# Altium schematic sheet Motor Control.SchDoc
size A
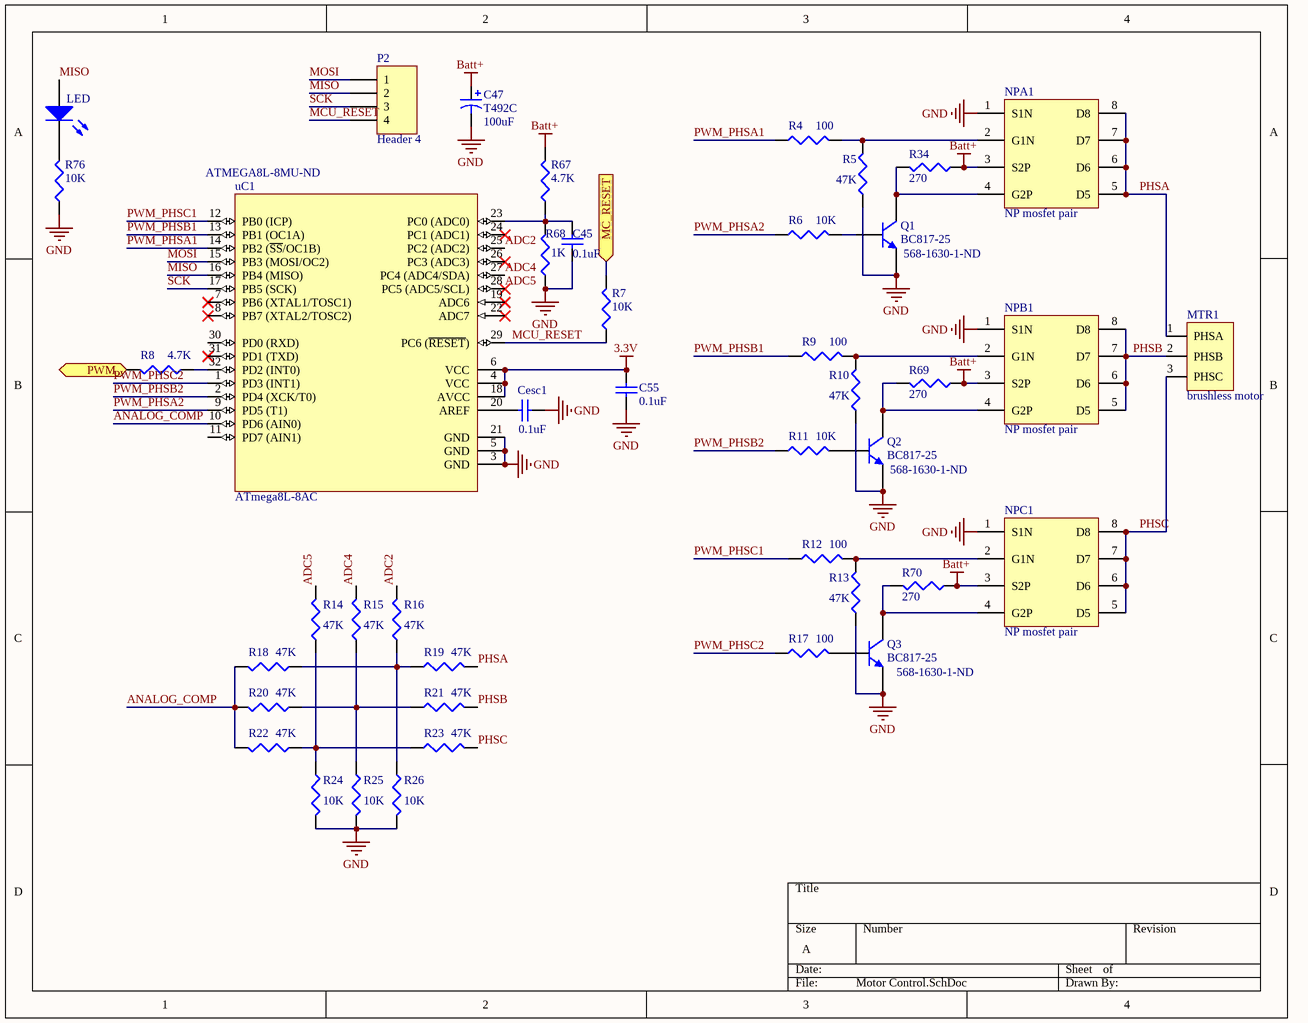
[diagram p0: Motor Control.SchDoc]

## Parts
C45  value 0.1uF  [0603_CAP]  (hidden comment: X7R Cap)
C47  T492C  value 100uF  [C]
C55  value 0.1uF  [0603_CAP]  (hidden comment: X7R Cap)
Cesc1  value 0.1uF  [0603_CAP]  (hidden comment: X7R Cap)
LED  LED0  [0603_RES]  (value not drawn)
MTR1  brushless motor  [Motor Combo]
NPA1  NP mosfet pair  [SOIC127P600-8L]
NPB1  NP mosfet pair  [SOIC127P600-8L]
NPC1  NP mosfet pair  [SOIC127P600-8L]
P2  Header 4  [PRG_HEADER]
Q1  BC817-25  Supplier Part Number 1: 568-1630-1-ND  [SOT-23]
Q2  BC817-25  Supplier Part Number 1: 568-1630-1-ND  [SOT-23]
Q3  BC817-25  Supplier Part Number 1: 568-1630-1-ND  [SOT-23]
R4  value 100  [0603_RES]  (hidden comment: Rpull)
R5  value 47K  [0603_RES]  (hidden comment: Rpull)
R6  value 10K  [0603_RES]  (hidden comment: Rdrive)
R7  value 10K  [0603_RES]  (hidden comment: Rpull)
R8  value 4.7K  [0603_RES]  (hidden comment: Rpull)
R9  value 100  [0603_RES]  (hidden comment: Rpull)
R10  value 47K  [0603_RES]  (hidden comment: Rpull)
R11  value 10K  [0603_RES]  (hidden comment: Rdrive)
R12  value 100  [0603_RES]  (hidden comment: Rpull)
R13  value 47K  [0603_RES]  (hidden comment: Rpull)
R14  value 47K  [0603_RES]  (hidden comment: Rpull)
R15  value 47K  [0603_RES]  (hidden comment: Rpull)
R16  value 47K  [0603_RES]  (hidden comment: Rpull)
R17  value 100  [0603_RES]  (hidden comment: Rpull)
R18  value 47K  [0603_RES]  (hidden comment: Rpull)
R19  value 47K  [0603_RES]  (hidden comment: Rpull)
R20  value 47K  [0603_RES]  (hidden comment: Rpull)
R21  value 47K  [0603_RES]  (hidden comment: Rpull)
R22  value 47K  [0603_RES]  (hidden comment: Rpull)
R23  value 47K  [0603_RES]  (hidden comment: Rpull)
R24  value 10K  [0603_RES]  (hidden comment: Rpull)
R25  value 10K  [0603_RES]  (hidden comment: Rpull)
R26  value 10K  [0603_RES]  (hidden comment: Rpull)
R34  value 270  [0603_RES]  (hidden comment: Rpull)
R67  value 4.7K  [0603_RES]  (hidden comment: Rpull)
R68  value 1K  [0603_RES]  (hidden comment: Rpull)
R69  value 270  [0603_RES]  (hidden comment: Rpull)
R70  value 270  [0603_RES]  (hidden comment: Rpull)
R76  value 10K  [0603_RES]  (hidden comment: Rpull)
uC1  ATmega8L-8AC  Supplier Part Number 1: ATMEGA8L-8MU-ND  [32A_N]

## Ports
MC_RESET (in), PWM (in)

## Nets
3.3V: C55.1 uC1.4(VCC) uC1.6(VCC) uC1.18(AVCC)
Batt+: C47.1 NPA1.3(S2P) NPB1.3(S2P) NPC1.3(S2P) R34.1 R67.2 R69.1 R70.1
GND: C45.2 C47.2 C55.2 Cesc1.1 NPA1.1(S1N) NPB1.1(S1N) NPC1.1(S1N) Q1.2(E) Q2.2(E) Q3.2(E) R5.1 R10.1 R13.1 R24.2 R25.2 R26.2 R68.1 R76.1 uC1.3(GND) uC1.5(GND) uC1.21(GND)
ADC2: R16.2 uC1.25(PC2_(ADC2))
ADC4: R15.2 uC1.27(PC4_(ADC4/SDA))
ADC5: R14.2 uC1.28(PC5_(ADC5/SCL))
ANALOG_COMP: R18.2 R20.2 R22.2 uC1.10(PD6_(AIN0))
MC_RESET: R7.2 ; port MC_RESET
MCU_RESET: P2.4 R7.1 uC1.29(PC6_(~{RESET}))
MISO: LED.1(A) P2.2 uC1.16(PB4_(MISO))
MOSI: P2.1 uC1.15(PB3_(MOSI/OC2))
PHSA: MTR1.1(PHSA) NPA1.5(D5) NPA1.6(D6) NPA1.7(D7) NPA1.8(D8) R19.2
PHSB: MTR1.2(PHSB) NPB1.5(D5) NPB1.6(D6) NPB1.7(D7) NPB1.8(D8) R21.2
PHSC: MTR1.3(PHSC) NPC1.5(D5) NPC1.6(D6) NPC1.7(D7) NPC1.8(D8) R23.2
PWM: R8.2 ; port PWM
PWM_PHSA1: R4.1 uC1.14(PB2_(~{SS}/OC1B))
PWM_PHSA2: R6.1 uC1.9(PD5_(T1))
PWM_PHSB1: R9.1 uC1.13(PB1_(OC1A))
PWM_PHSB2: R11.1 uC1.2(PD4_(XCK/T0))
PWM_PHSC1: R12.1 uC1.12(PB0_(ICP))
PWM_PHSC2: R17.1 uC1.1(PD3_(INT1))
SCK: P2.3 uC1.17(PB5_(SCK))
NetC45_1: C45.1 R67.1 R68.2 uC1.23(PC0_(ADC0))
NetCesc1_2: Cesc1.2 uC1.20(AREF)
NetLED_2: LED.2(K) R76.2
NetNPA1_2: NPA1.2(G1N) R4.2 R5.2
NetNPA1_4: NPA1.4(G2P) Q1.3(C) R34.2
NetNPB1_2: NPB1.2(G1N) R9.2 R10.2
NetNPB1_4: NPB1.4(G2P) Q2.3(C) R69.2
NetNPC1_2: NPC1.2(G1N) R12.2 R13.2
NetNPC1_4: NPC1.4(G2P) Q3.3(C) R70.2
NetQ1_1: Q1.1(B) R6.2
NetQ2_1: Q2.1(B) R11.2
NetQ3_1: Q3.1(B) R17.2
NetR8_1: R8.1 uC1.32(PD2_(INT0))
NetR14_1: R14.1 R22.1 R23.1 R24.1
NetR15_1: R15.1 R20.1 R21.1 R25.1
NetR16_1: R16.1 R18.1 R19.1 R26.1

Not connected (* = marked no-connect by the designer): uC1 7(PB6_(XTAL1/TOSC1))* 8(PB7_(XTAL2/TOSC2))* 11(PD7_(AIN1)) 19(ADC6)* 22(ADC7)* 24(PC1_(ADC1))* 26(PC3_(ADC3))* 30(PD0_(RXD)) 31(PD1_(TXD))*

## Library data of the parts
C45 C55 Cesc1 = Cap: Capacitor; Published: 8-Jun-2000; LatestRevisionDate: 17-Jul-2002; LatestRevisionNote: Re-released for DXP Platform.; PackageReference: RAD-0.3; Publisher: Altium Limited
C47 = T492C: Solid Tantalum Chip Capacitor, T492 Series - CWR11 Style Per Mil-PRF-55365/8; Manufacturer: Kemet; Manufacturer Part Number: T491C107K016ZT; Description: CAP TANT 100UF 16V 10% 2312; Capacitance: 100µF; Voltage - Rated: 16V; Tolerance: ±10%; ESR (Equivalent Series Resistance): 1.000 Ohm; Type: Molded; Published: 17-Jul-2002; LatestRevisionDate: 19-Mar-2004; LatestRevisionNote: Silkscreen dimensions re-sized.; DatasheetDocument: Mar-2001; PackageDocument: Mar-2001; PackageReference: C; Publisher: Altium Limited; Code_JEITA: 6032-28; ComponentLink1Description: Manufacturer Link; ComponentLink1URL: http://www.kemet.com/; ComponentLink2Description: Datasheet; ComponentLink2URL: http://www.kemet.com/kemet/web/homepage/kechome.nsf/vapubfilesname/F3102TA.pdf/$file/F3102TA.pdf; Supplier 1: Digi-Key; Supplier Part Number 1: 399-5214-1-ND; RoHS: RoHS Compliant; Category: Capacitors; Stock 1: 83455; Pricing 1: 1=1.34, 10=1.117, 25=0.9624, 100=0.8197, 250=0.7128 (USD); Operating Temperature: -55°C ~ 125°C; Mounting Type: Surface Mount; Package / Case: 2312 (6032 Metric); Size / Dimension: 0.236" L x 0.126" W (6.00mm x 3.20mm); Height - Seated (Max): 0.110" (2.80mm); Lead Spacing: -; Manufacturer Size Code: C; Features: General Purpose; Packaging: Cut Tape (CT); Lifetime @ Temp.: -; ComponentLink3URL: http://www.kemet.com/datasheets&T491C107K016ZT; ComponentLink3Description: http://www.kemet.com/datasheets&T491C107K016ZT
LED = LED0: Typical INFRARED GaAs LED; Published: 8-Jun-2000; LatestRevisionDate: 08-Jul-2005; LatestRevisionNote: Mech Layer 1 removed.; PackageReference: LED-0; Publisher: Altium Limited
MTR1 = MOTOR
NPA1 NPB1 NPC1 = AP4503AGM
P2 = Header 4: Header, 4-Pin; LatestRevisionDate: 17-Jul-2002; LatestRevisionNote: Re-released for DXP Platform.; Publisher: Altium Limited
Q1-Q3 = BC817-25: NPN General Purpose Amplifier; Manufacturer: NXP Semiconductors; Manufacturer Part Number: BC817-25,215; Description: TRANS NPN GP 500 45V SOT23; Current - Collector (Ic) (Max): 500mA; Voltage - Collector Emitter Breakdown (Max): 45V; Vce Saturation (Max) @ Ib, Ic: 700mV @ 50mA, 500mA; DC Current Gain (hFE) (Min) @ Ic, Vce: 160 @ 100mA, 1V; Power - Max: 250mW; Frequency - Transition: 100MHz; Published: 8-Jun-2000; LatestRevisionDate: 17-Jul-2002; LatestRevisionNote: Re-released for DXP Platform.; DatasheetDocument: 1997; PackageDocument: Sep-1998; PackageReference: SOT-23A; Publisher: Altium Limited; ComponentLink1Description: Manufacturer Link; ComponentLink1URL: http://www.fairchildsemi.com/; ComponentLink2Description: Discontinuation Notice; ComponentLink2URL: http://www.fairchildsemi.com/obsolete/obs.jsp; Supplier 1: Digi-Key; RoHS: RoHS Compliant; Category: Discrete Semiconductor Products; Stock 1: 211227; Pricing 1: 1=0.33, 10=0.216, 25=0.1412, 100=0.094, 250=0.06112, 500=0.04324, 1000=0.03055 (USD); Transistor Type: NPN; Current - Collector Cutoff (Max): -; Mounting Type: Surface Mount; Package / Case: TO-236-3, SC-59, SOT-23-3; Supplier Device Package: TO-236AB; Packaging: Cut Tape (CT); ComponentLink3URL: http://www.nxp.com/documents/data_sheet/BC817_BC817W_BC337.pdf; ComponentLink3Description: http://www.nxp.com/documents/data_sheet/BC817_BC817W_BC337.pdf
R4-R26 R34 R67-R70 R76 = Rpull: Resistor; Published: 8-Jun-2000; LatestRevisionDate: 29-May-2009; LatestRevisionNote: IPC-7351 Footprint Added.; PackageReference: J1-0603; Publisher: Altium Limited; PackageDescription: Chip Resistor
uC1 = ATmega8L-8AC: 8-Bit AVR Microcontroller with 8K Bytes of In-System Programmable Flash Memory; Manufacturer: Atmel; Manufacturer Part Number: ATMEGA8L-8AU; Description: IC AVR MCU 8K 8MHZ 3V 32TQFP; Speed: 8MHz; Connectivity: I²C, SPI, UART/USART; Peripherals: Brown-out Detect/Reset, POR, PWM, WDT; Number of I /O: 23; Program Memory Size: 8KB (4K x 16); EEPROM Size: 512 x 8; RAM Size: 1K x 8; Voltage - Supply (Vcc/Vdd): 2.7 V ~ 5.5 V; Data Converters: A/D 8x10b; Oscillator Type: Internal; Published: 17-Sep-2003; LatestRevisionDate: 13-Apr-2006; LatestRevisionNote: IPC-7351 Footprint Added.; DatasheetVersion: 2486H-AVR-09/02; PackageVersion: revB, Oct-2001; PackageReference: 32A; Publisher: Altium Limited; PackageDescription: 32-Pin Thin Quad Flat Pack 0.8 mm Pitch; Code_JEDEC: MS-026-ABA; ComponentLink2Description: Datasheet; RoHS: RoHS Compliant; Category: Integrated Circuits (ICs); Core Processor: AVR; Core Size: 8-Bit; Program Memory Type: FLASH; Operating Temperature: -40°C ~ 85°C; Package / Case: 32-TQFP; Packaging: Tray; ComponentLink3Description: http://www.atmel.com/dyn/resources/prod_documents/2486S.pdf; ComponentLink1URL: http://www.atmel.com/dyn/resources/prod_documents/2486S.pdf; ComponentLink1Description: http://www.atmel.com/dyn/resources/prod_documents/2486S.pdf; Supplier 1: Digi-Key; Stock 1: 11751; Pricing 1: 1=3.55, 25=2.2276, 100=1.98 (USD)